# Altium schematic sheet Connector.SchDoc
size A4
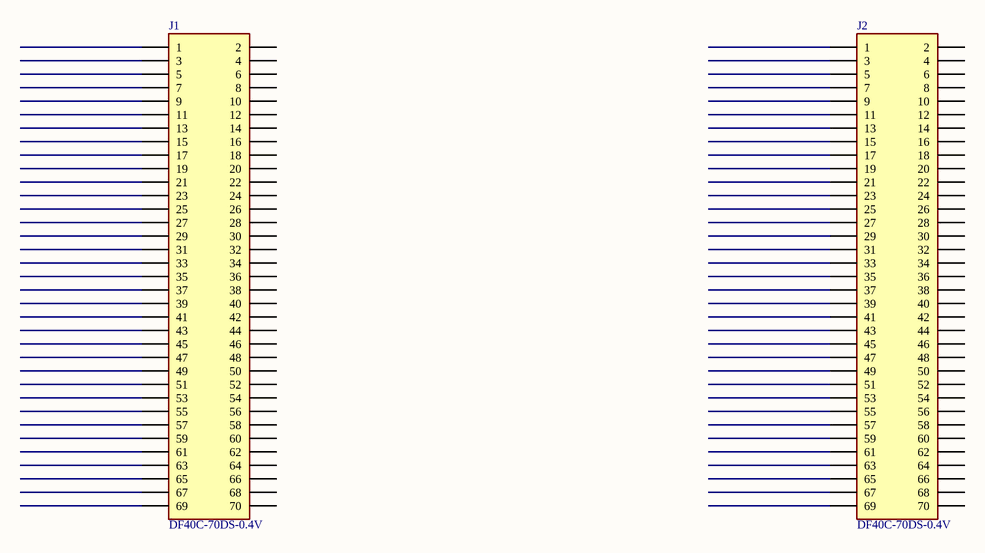
[diagram p0: Connector.SchDoc]

## Parts
J1  DF40C-70DS-0.4V  [DF40C-70DS-0.4V-MALE]
J2  DF40C-70DS-0.4V  [DF40C-70DS-0.4V-MALE]

## Nets

Not connected (* = marked no-connect by the designer): J1 1 2 3 4 5 6 7 8 9 10 11 12 13 14 15 16 17 18 19 20 21 22 23 24 25 26 27 28 29 30 31 32 33 34 35 36 37 38 39 40 41 42 43 44 45 46 47 48 49 50 51 52 53 54 55 56 57 58 59 60 61 62 63 64 65 66 67 68 69 70; J2 1 2 3 4 5 6 7 8 9 10 11 12 13 14 15 16 17 18 19 20 21 22 23 24 25 26 27 28 29 30 31 32 33 34 35 36 37 38 39 40 41 42 43 44 45 46 47 48 49 50 51 52 53 54 55 56 57 58 59 60 61 62 63 64 65 66 67 68 69 70

## Library data of the parts
J1 J2 = DF40C-70DS-0.4V: 70 Position Connector Receptacle, Center Strip Contacts Surface Mount Gold; MP: DF40C-70DS-0.4V_51_; MF: Hirose; Package: None; SnapEDA_Link: https://www.snapeda.com/parts/DF40C-70DS-0.4V%2851%29/Hirose%20Electric%20Co%20Ltd/view-part/50152/?ref=snap; Price: None; Value: *; Availability: Unavailable